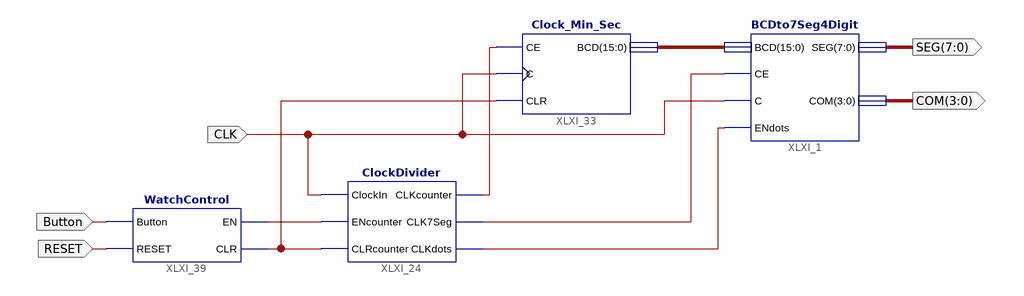
[diagram p0: schematic sheet 1]
// Xilinx ISE schematic StopWatch.sch (spartan6) as structural Verilog: 4 symbols, 5 ports
module StopWatch (
  input  CLK,
  input  RESET,
  input  Button,
  output [7:0] SEG,
  output [3:0] COM
);

  wire XLXN_230, XLXN_232, XLXN_241, XLXN_245, XLXN_276;
  wire [15:0] XLXN_223;

  BCDto7Seg4Digit XLXI_1 (.BCD(XLXN_223), .C(CLK), .CE(XLXN_232), .COM(COM), .SEG(SEG), .ENdots(XLXN_241));
  Clock_Min_Sec XLXI_33 (.BCD(XLXN_223), .CLR(XLXN_245), .CE(XLXN_230), .C(CLK));
  ClockDivider XLXI_24 (
    .ClockIn(CLK), .ENcounter(XLXN_276), .CLK7Seg(XLXN_232), .CLKcounter(XLXN_230), .CLKdots(XLXN_241),
    .CLRcounter(XLXN_245));
  WatchControl XLXI_39 (.EN(XLXN_276), .CLR(XLXN_245), .RESET(RESET), .Button(Button));
endmodule
